# EasyEDA schematic SCH_PCB_2026-08-12.json
TITLE: PCB fo dog robot; REV: 1.0; Date: 2026-08-11; Sheet: 1/1; Drawn By: amalaaa580; Company: smart method
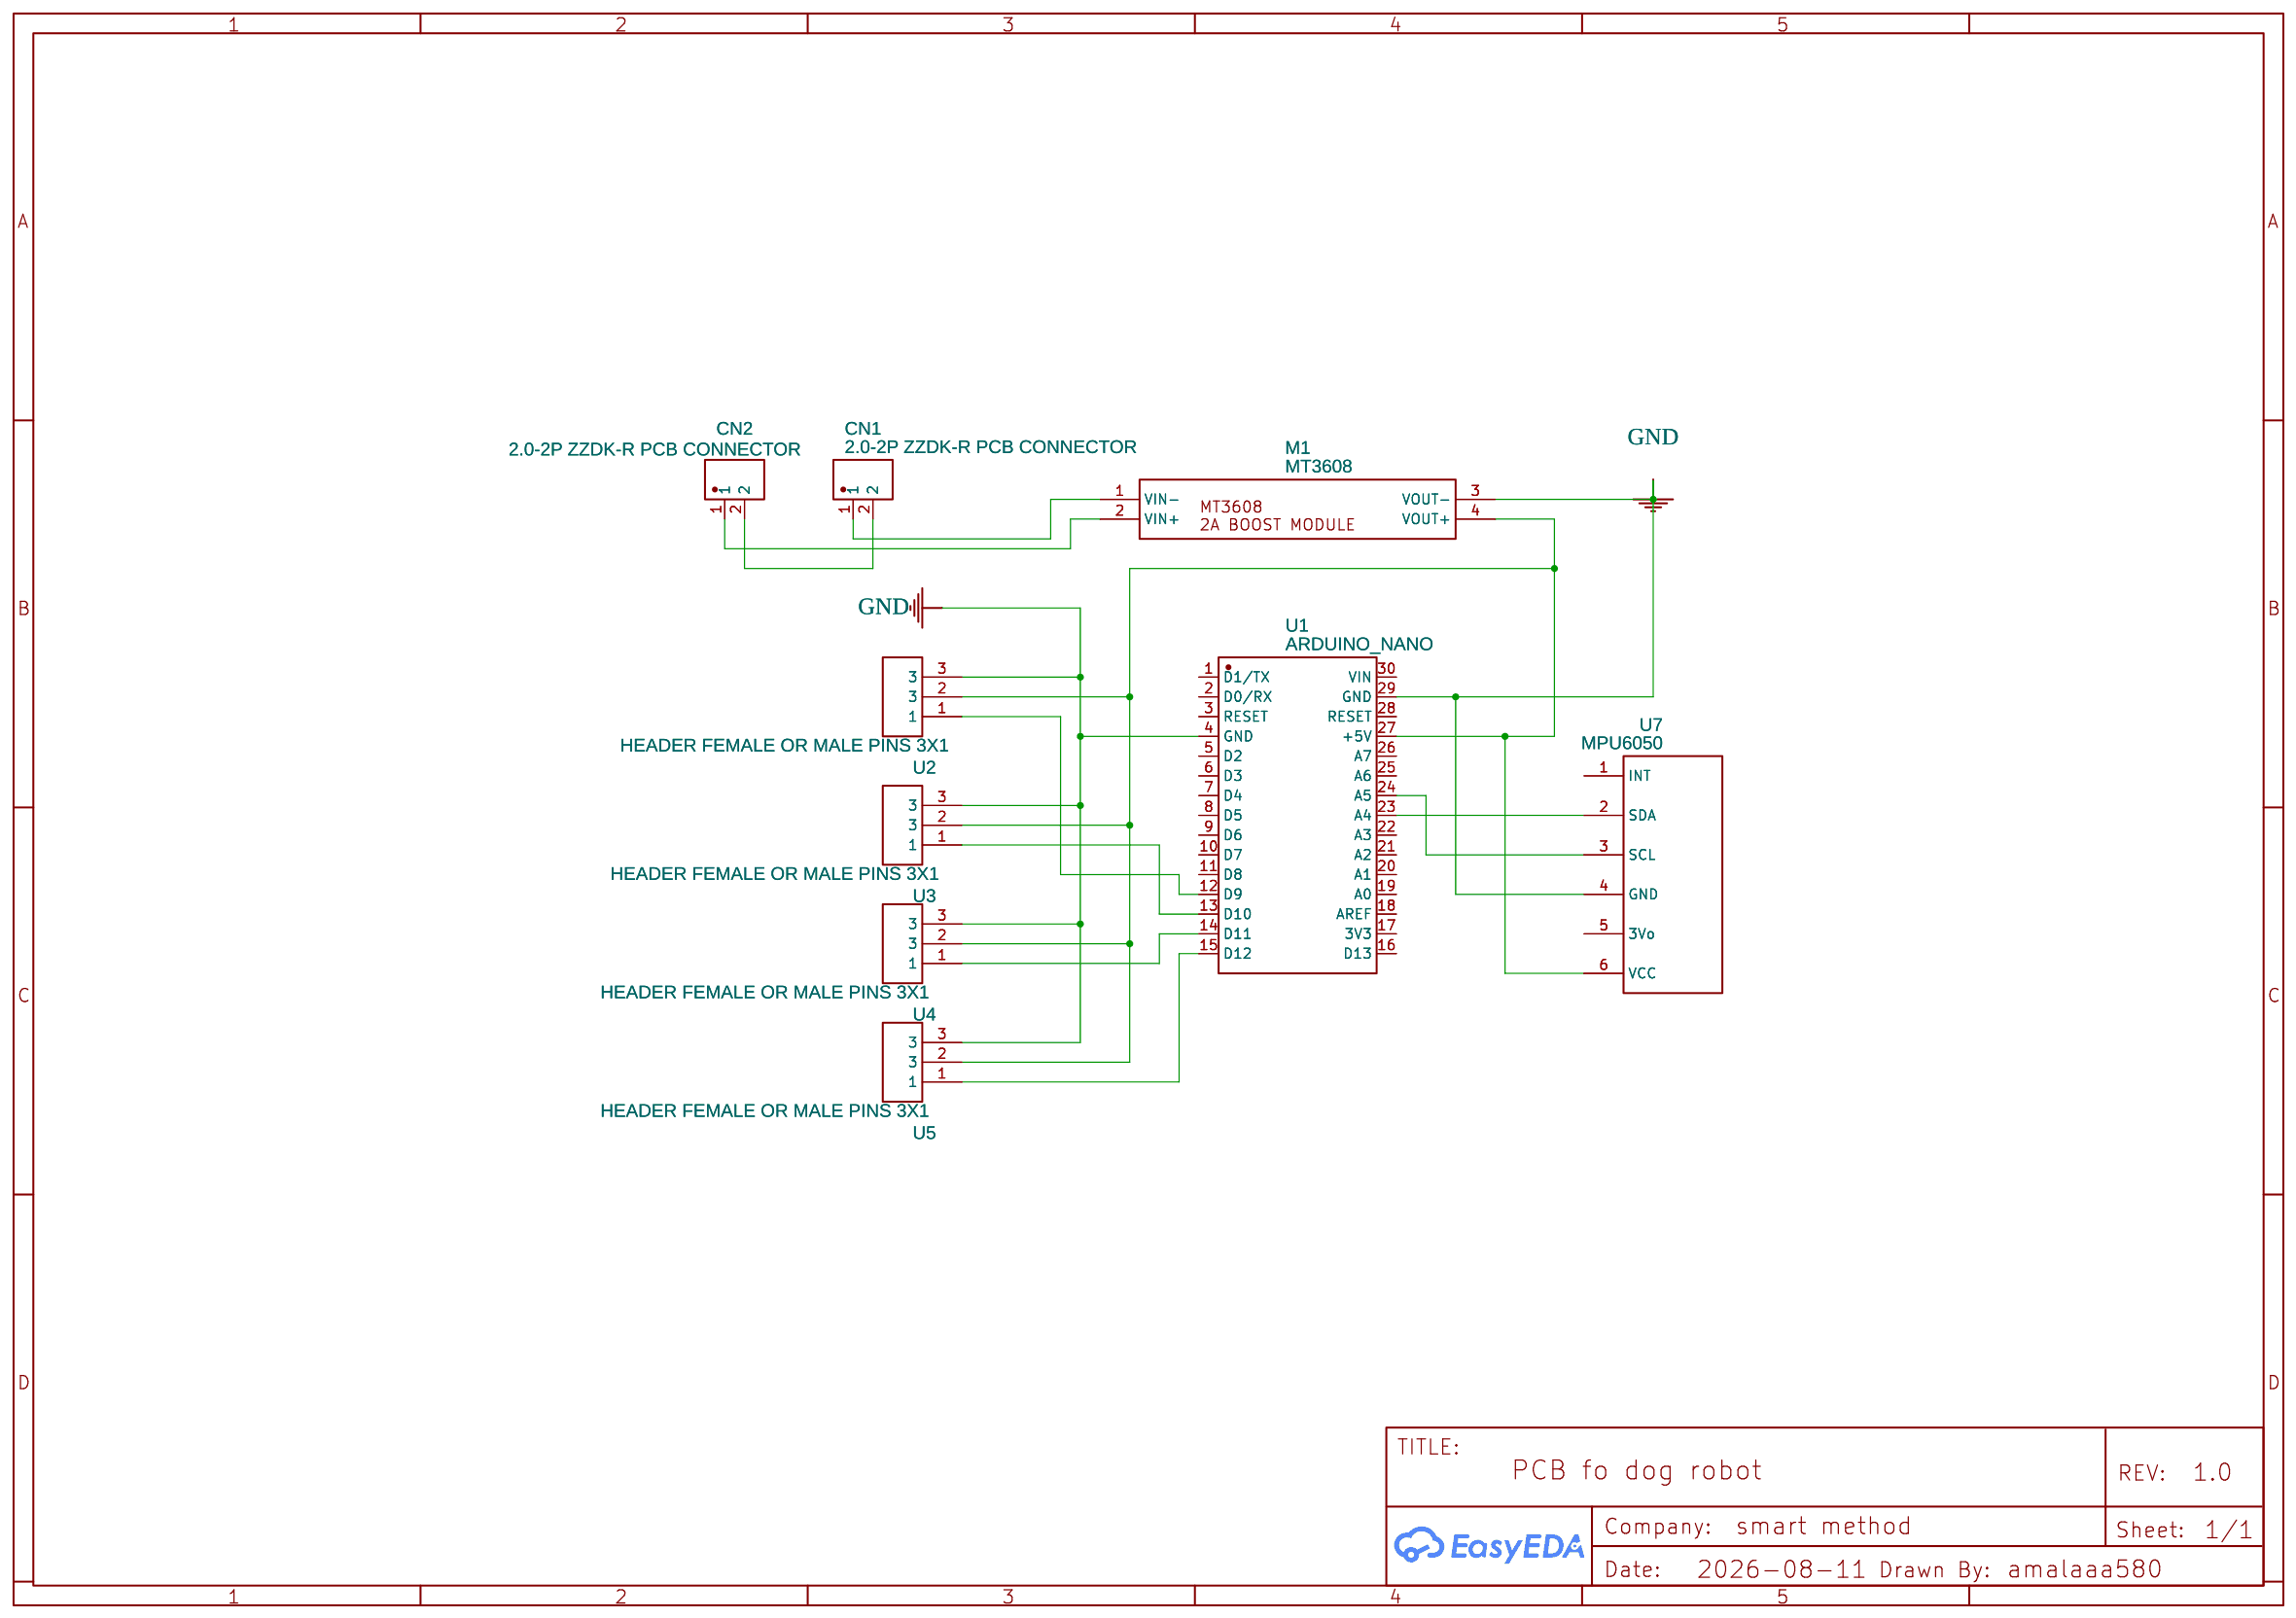
[diagram p0: schematic sheet]

## Parts
CN1  2.0-2P ZZDK-R PCB CONNECTOR  [CONN-TH_2.0-2P-ZZDK-R-PCB-CONNECTOR]
CN2  2.0-2P ZZDK-R PCB CONNECTOR  [CONN-TH_2.0-2P-ZZDK-R-PCB-CONNECTOR]
M1  MT3608  [COMM-SMD_MT3608]
U1  ARDUINO_NANO  [COMM-TH_ARDUINO_NANO]
U2  HEADER FEMALE OR MALE PINS 3X1  [HEADER FEMALE OR MALE PINS 3X1]
U3  HEADER FEMALE OR MALE PINS 3X1  [HEADER FEMALE OR MALE PINS 3X1]
U4  HEADER FEMALE OR MALE PINS 3X1  [HEADER FEMALE OR MALE PINS 3X1]
U5  HEADER FEMALE OR MALE PINS 3X1  [HEADER FEMALE OR MALE PINS 3X1]
U7  MPU6050  [MPU6050]

## Library data of the parts
CN1 CN2 = 2.0-2P ZZDK-R PCB CONNECTOR: Supplier: LCSC; Supplier Part: C49023773; Manufacturer: SHOU HAN(首韩); Manufacturer Part: 2.0-2P ZZDK-R PCB Connector; JLCPCB Part Class: Extended Part; Contributor: lcsc
M1 = MT3608: Contributor: uextensionality
U1 = ARDUINO_NANO: Contributor: lcsc; Supplier: LCSC; Supplier Part: C9900017879; Manufacturer: null; JLCPCB Part Class: Extended Part
U2-U5 = HEADER FEMALE OR MALE PINS 3X1: Contributor: Guest
U7 = MPU6050: Contributor: sunggunlee

## Nets
GND: M1.3(VOUT-) U1.4(GND) U1.29(GND) U2.3 U3.3 U4.3 U5.3 U7.4(GND)
Net-(CN1-1): CN1.1 M1.1(VIN-)
Net-(CN1-2): CN1.2 CN2.2
Net-(CN2-1): CN2.1 M1.2(VIN+)
Net-(M1-4): M1.4(VOUT+) U1.27(+5V) U2.2(3) U3.2(3) U4.2(3) U5.2(3) U7.6(VCC)
Net-(U1-12): U1.12(D9) U2.1
Net-(U1-13): U1.13(D10) U3.1
Net-(U1-14): U1.14(D11) U4.1
Net-(U1-15): U1.15(D12) U5.1
Net-(U1-23): U1.23(A4) U7.2(SDA)
Net-(U1-24): U1.24(A5) U7.3(SCL)

Not connected (* = marked no-connect by the designer): U1 1(D1/TX) 2(D0/RX) 3(RESET) 5(D2) 6(D3) 7(D4) 8(D5) 9(D6) 10(D7) 11(D8) 16(D13) 17(3V3) 18(AREF) 19(A0) 20(A1) 21(A2) 22(A3) 25(A6) 26(A7) 28(RESET) 30(VIN); U7 1(INT) 5(3Vo)
